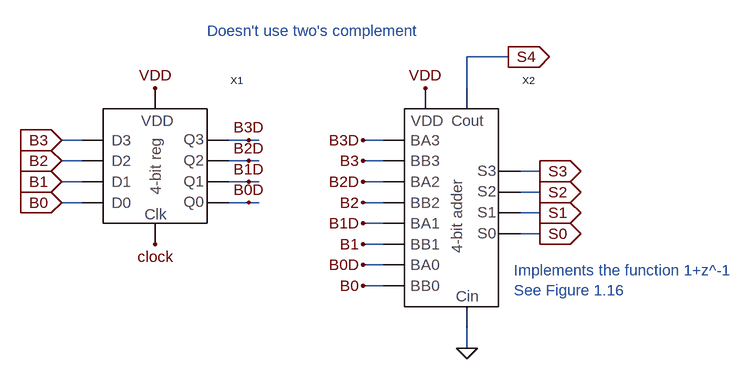
[diagram p0: schematic 4_bit_averager.asc]
4_bit_averager.asc, the LTspice schematic file:
Version 4
SHEET 1 1324 932
WIRE 240 -752 176 -752
WIRE 176 -704 176 -752
WIRE -416 -624 -448 -624
WIRE -160 -624 -192 -624
WIRE -144 -624 -160 -624
WIRE 48 -624 16 -624
WIRE -416 -592 -448 -592
WIRE -160 -592 -192 -592
WIRE -144 -592 -160 -592
WIRE 48 -592 16 -592
WIRE 288 -576 256 -576
WIRE -416 -560 -448 -560
WIRE -160 -560 -192 -560
WIRE -144 -560 -160 -560
WIRE 48 -560 16 -560
WIRE 288 -544 256 -544
WIRE -416 -528 -448 -528
WIRE -160 -528 -192 -528
WIRE -144 -528 -160 -528
WIRE 48 -528 16 -528
WIRE 288 -512 256 -512
WIRE 48 -496 16 -496
WIRE 288 -480 256 -480
WIRE 48 -464 16 -464
WIRE 48 -432 16 -432
WIRE 48 -400 16 -400
WIRE 176 -304 176 -336
FLAG -304 -704 VDD
FLAG -304 -464 clock
FLAG 112 -704 VDD
FLAG -448 -624 B3
IOPIN -448 -624 In
FLAG -448 -592 B2
IOPIN -448 -592 In
FLAG -448 -560 B1
IOPIN -448 -560 In
FLAG -448 -528 B0
IOPIN -448 -528 In
FLAG -160 -624 B3D
FLAG -160 -592 B2D
FLAG -160 -560 B1D
FLAG -160 -528 B0D
FLAG 240 -752 S4
IOPIN 240 -752 Out
FLAG 288 -576 S3
IOPIN 288 -576 Out
FLAG 288 -544 S2
IOPIN 288 -544 Out
FLAG 288 -512 S1
IOPIN 288 -512 Out
FLAG 288 -480 S0
IOPIN 288 -480 Out
FLAG 16 -592 B3
FLAG 16 -528 B2
FLAG 16 -464 B1
FLAG 16 -400 B0
FLAG 16 -432 B0D
FLAG 16 -496 B1D
FLAG 16 -560 B2D
FLAG 16 -624 B3D
FLAG 176 -304 0
SYMBOL 4_bit_register -384 -496 R0
SYMATTR InstName X1
SYMBOL 4_bit_adder 80 -368 R0
SYMATTR InstName X2
TEXT 248 -424 Left 0 ;Implements the function 1+z^-1\nSee Figure 1.16
TEXT -224 -792 Left 0 ;Doesn't use two's complement

The netlist it stands for:
* 4_bit_averager.asc
XX1 B0 B1 B2 B3 B0D B1D B2D B3D clock VDD 4_bit_register  ; pins D0 D1 D2 D3 Q0 Q1 Q2 Q3 Clk VDD
XX2 B0D B0 B1D B1 B2D B2 B3D B3 S0 S1 S2 S3 0 S4 VDD 4_bit_adder  ; pins BA0 BB0 BA1 BB1 BA2 BB2 BA3 BB3 S0 S1 S2 S3 Cin Cout VDD
* Implements the function 1+z^-1
* See Figure 1.16
* Doesn't use two's complement
.backanno
.end